# EAGLE design crowd chase el (EAGLE 6.5.0)
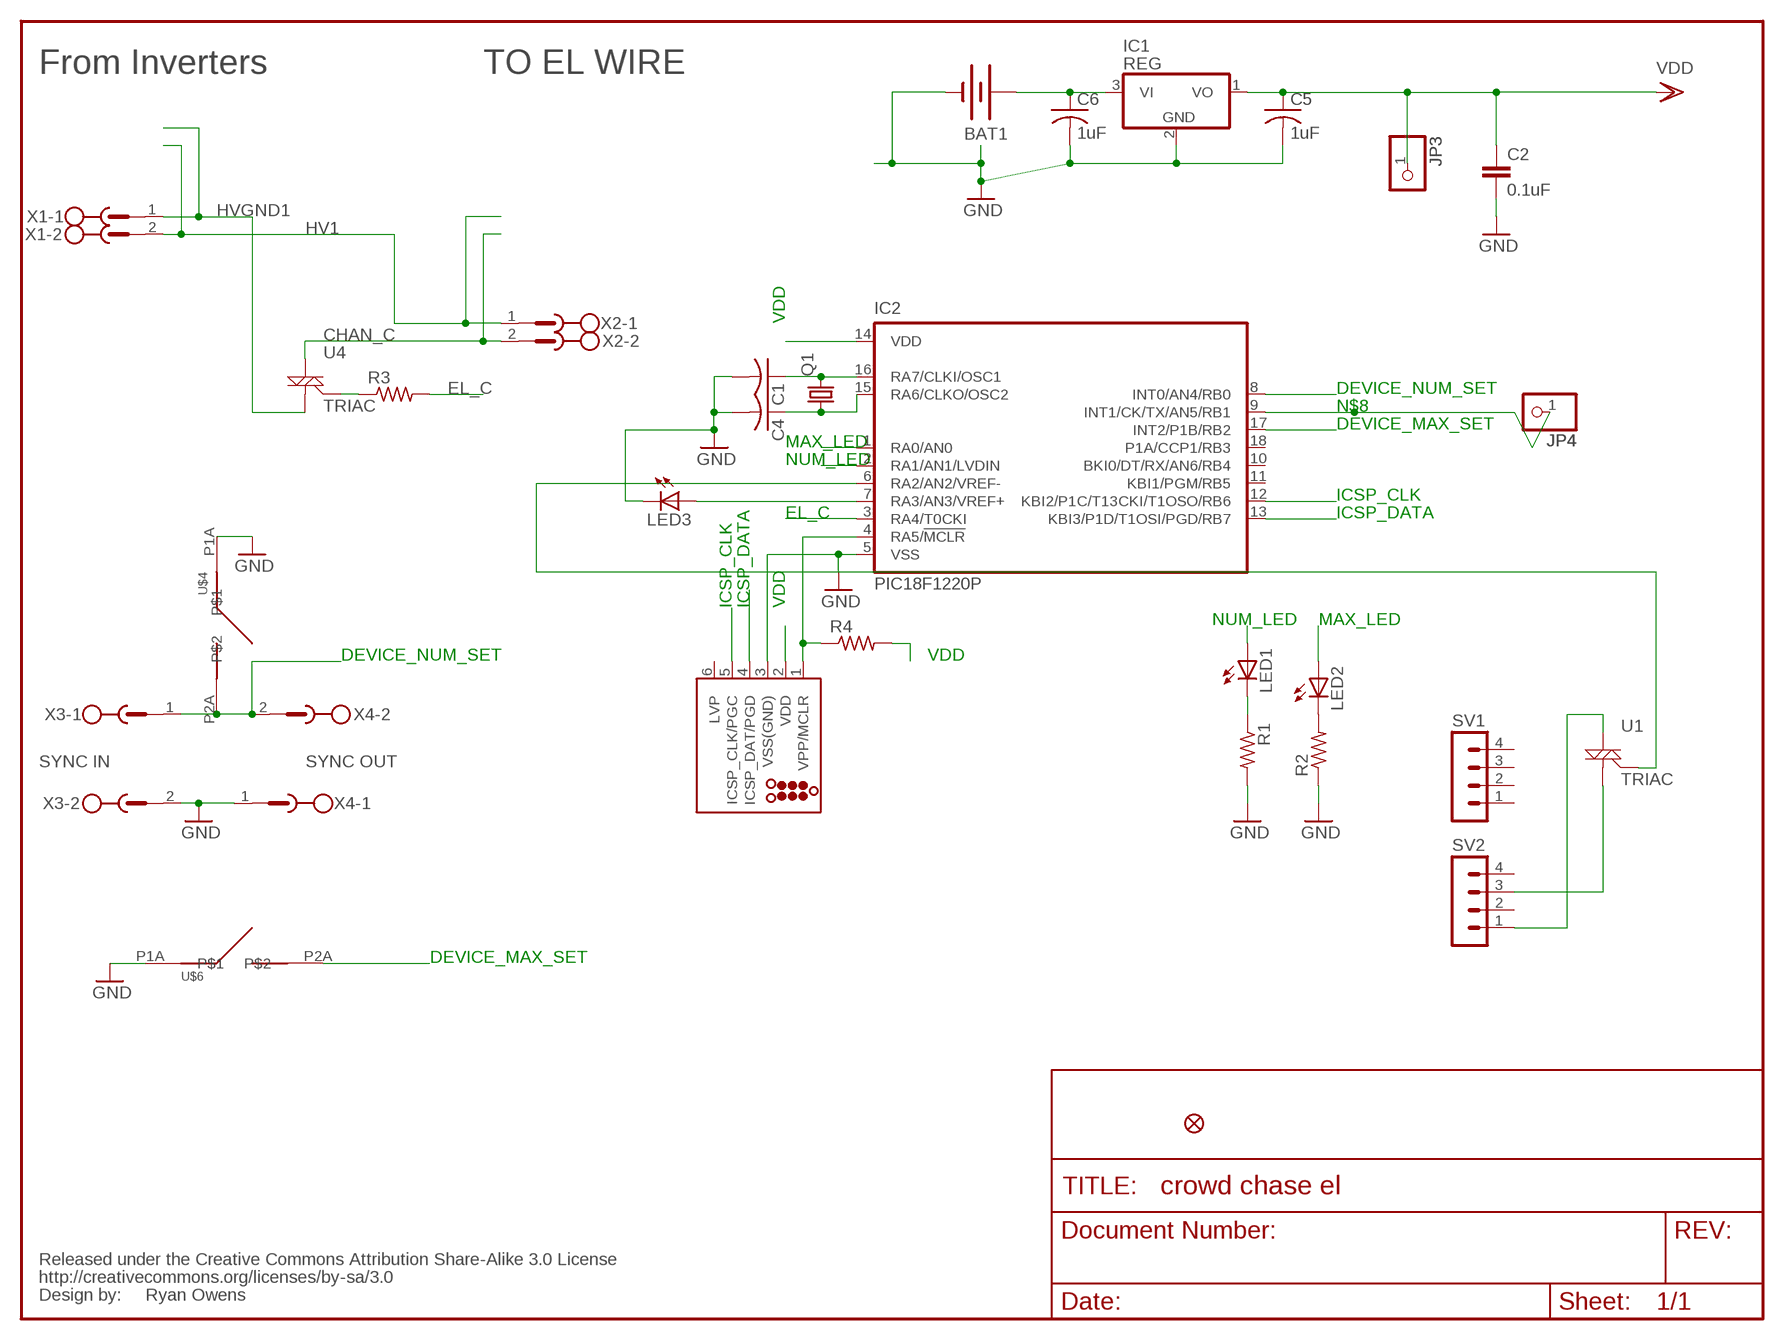
[diagram p0: schematic, sheet 1]

## Parts
BAT1  BATTERY20SMD-L  [BATTCON_20MM]
C1  C-US025-025X050  [C025-025X050]
C2  0.1uF  CAPPTH2  [CAP-PTH-SMALL2]
C4  C-US025-025X050  [C025-025X050]
C5  1uF  C-US025-025X050  [C025-025X050]
C6  1uF  C-US025-025X050  [C025-025X050]
IC1  REG  7805L  [TO92]
IC2  PIC18F1220P  [DIL18]
J2  TC2030  [TC2030-MCP-NL-CP]
JP3  PINHEADER_1X1  [HEADER_DIP_1X01]
JP4  PINHEADER_1X1  [HEADER_DIP_1X01]
LED1  LED3MM  [LED3MM]
LED2  LED3MM  [LED3MM]
LED3  LED3MM  [LED3MM]
Q1  CRYSTALHC49S  [HC49/S]
R1  R-US_0204/5  [0204/5]
R2  R-US_0204/5  [0204/5]
R3  R-US_0204/5  [0204/5]
R4  R-US_0204/5  [0204/5]
SV1  MA04-1  [MA04-1]
SV2  MA04-1  [MA04-1]
U1  TRIAC  TRIACPTH  [TO-92]
U4  TRIAC  TRIACPTH  [TO-92]
U$2  FIDUCIAL1X2  [FIDUCIAL-1X2]
U$4  12MMTACT_MJTP1212  [MJTP1212]
U$5  CREATIVE_COMMONS  [CREATIVE_COMMONS]
U$6  12MMTACT_MJTP1212  [MJTP1212]
X1  MSTBV2  [MSTBV2]
X2  MSTBV2  [MSTBV2]
X3  MSTBV2  [MSTBV2]
X4  MSTBV2  [MSTBV2]

## Nets
CHAN_C: U4.3(M2) X2.2
DEVICE_MAX_SET: IC2.17(INT2/P1B/RB2) U$6.P2A
DEVICE_NUM_SET: IC2.8(INT0/AN4/RB0) U$4.P2A X3.1 X4.2
EL_C: IC2.3(RA4/T0CKI) R3.2
GND: BAT1.2(-) C1.2 C2.2 C4.2 C5.2 C6.2 IC1.2(GND) IC2.5(VSS) J2.3(VSS(GND)) LED3.K(C) R1.2 R2.1 U$4.P1A U$6.P1A X3.2 X4.1
HV1: X1.2 X2.1
HVGND1: U4.1(M1) X1.1
ICSP_CLK: IC2.12(KBI2/P1C/T13CKI/T1OSO/RB6) J2.5(ICSP_CLK/PGC)
ICSP_DATA: IC2.13(KBI3/P1D/T1OSI/PGD/RB7) J2.4(ICSP_DAT/PGD)
MAX_LED: IC2.1(RA0/AN0) LED2.A
N$1: IC2.4(RA5/!MCLR) J2.1(VPP/MCLR) R4.1
N$2: C4.1 IC2.15(RA6/CLKO/OSC2) Q1.1
N$3: C1.1 IC2.16(RA7/CLKI/OSC1) Q1.2
N$5: LED1.K(C) R1.1
N$6: LED2.K(C) R2.2
N$7: IC2.7(RA3/AN3/VREF+) LED3.A
N$8: IC2.9(INT1/CK/TX/AN5/RB1) JP4.1
N$9: BAT1.3(+) C6.1 IC1.3(VI)
N$10: R3.1 U4.2(G)
N$12: SV2.1 U1.3(M2)
N$13: SV2.3 U1.1(M1)
N$14: IC2.6(RA2/AN2/VREF-) U1.2(G)
NUM_LED: IC2.2(RA1/AN1/LVDIN) LED1.A
VDD: C2.1 C5.1 IC1.1(VO) IC2.14(VDD) J2.2(VDD) JP3.1 R4.2
Unconnected: IC2.10(BKI0/DT/RX/AN6/RB4) IC2.11(KBI1/PGM/RB5) IC2.18(P1A/CCP1/RB3) J2.6(LVP) SV1.1 SV1.2 SV1.3 SV1.4 SV2.2 SV2.4

## Notes on the sheet
- From Inverters | TO EL WIRE
- SYNC IN | SYNC OUT
- Ryan Owens

## Library data of the parts
BAT1 = alertus-marquee:BATTERY: Battery Holders Various common sizes : AA, AAA, 20mm coin cell and 12mm coin cell.
C1 C4-C6 = rcl:C-US: CAPACITOR, American symbol
C2 = SparkFun:CAP: Capacitor Standard 0603 ceramic capacitor, and 0.1" leaded capacitor.
IC1 = linear:78*: Positive VOLTAGE REGULATOR Source: http://cache.national.com/ds/LM/LM78L05.pdf http://www.fairchildsemi.com/ds/LM/LM7805.pdf
IC2 = microchip:PIC18F1*20: 18/20/28-Pin High-Performance, Enhanced Flash Microcontrollers with 10-bit A/D and nanoWatt Technology Source: ww1.microchip.com/downloads/en/DeviceDoc/39605c.pdf; MF: MICROCHIP; MPN: PIC18F1220-I/P; OC_FARNELL: 9761977; OC_NEWARK: 92C2429
J2 = tag-connect:TC2030: TAG-CONNECT ICSP Connector Manufacturer: Tag-Connect <http://www.tag-connect.com> Cable for easy In-Circuit Serial Programming. Designed for Microchip ICD2, suitable for many others. Two variants - one "with legs" (for hands-free fit on PCB) and another "without legs" for quick programming. PAD Description 1 MCLR/Vpp 2 Vdd 3 GND 4 PGD (ISPDAT) 5 PGC (ISPCLK) 6 nc (used for LVP) ©2009 ROFA.cz - modified and updated by Robert Darlington ‹rdarlington@gmail.com›
JP3 JP4 = alertus-general:PINHEADER_1X1: PIN HEADER
LED1-LED3 = led:LED: LED OSRAM: - CHIPLED LG R971, LG N971, LY N971, LG Q971, LY Q971, LO R971, LY R971 LH N974, LH R974 LS Q976, LO Q976, LY Q976 LO Q996 - Hyper CHIPLED LW Q18S LB Q993, LB Q99A, LB R99A - SideLED LS A670, LO A670, LY A670, LG A670, LP A670 LB A673, LV A673, LT A673, LW A673 LH A674 LY A675 LS A676, LA A676, LO A676, LY A676, LW A676 LS A679, LY A679, LG A679 - Hyper Micro SIDELED® LS Y876, LA Y876, LO Y876, LY Y876 LT Y87S - SmartLED LW L88C, LW L88S LB L89C, LB L89S, LG L890 LS L89K, LO L89K, LY L89K LS L896, LA L896, LO L896, LY L896 - TOPLED LS T670, LO T670, LY T670, LG T670, LP T670 LSG T670, LSP T670, LSY T670, LOP T670, LYG T670 LG T671, LOG T671, LSG T671 LB T673, LV T673, LT T673, LW T673 LH T674 LS T676, LA T676, LO T676, LY T676, LB T676, LH T676, LSB T676, LW T676 LB T67C, LV T67C, LT T67C, LS T67K, LO T67K, LY T67K, LW E67C LS E67B, LA E67B, LO E67B, LY E67B, LB E67C, LV E67C, LT E67C LW T67C LS T679, LY T679, LG T679 LS T770, LO T770, LY T770, LG T770, LP T770 LB T773, LV T773, LT T773, LW T773 LH T774 LS E675, LA E675, LY E675, LS T675 LS T776, LA T776, LO T776, LY T776, LB T776 LHGB T686 LT T68C, LB T68C - Hyper Mini TOPLED® LB M676 - Mini TOPLED Santana® LG M470 LS M47K, LO M47K, LY M47K Source: http://www.osram.convergy.de LUXEON: - LUMILED® LXK2-PW12-R00, LXK2-PW12-S00, LXK2-PW14-U00, LXK2-PW14-V00 LXK2-PM12-R00, LXK2-PM12-S00, LXK2-PM14-U00 LXK2-PE12-Q00, LXK2-PE12-R00, LXK2-PE12-S00, LXK2-PE14-T00, LXK2-PE14-U00 LXK2-PB12-K00, LXK2-PB12-L00, LXK2-PB12-M00, LXK2-PB14-N00, LXK2-PB14-P00, LXK2-PB14-Q00 LXK2-PR12-L00, LXK2-PR12-M00, LXK2-PR14-Q00, LXK2-PR14-R00 LXK2-PD12-Q00, LXK2-PD12-R00, LXK2-PD12-S00 LXK2-PH12-R00, LXK2-PH12-S00 LXK2-PL12-P00, LXK2-PL12-Q00, LXK2-PL12-R00 Source: www.luxeon.com KINGBRIGHT: KA-3528ASYC Source: www.kingbright.com
Q1 = crystal:CRYSTAL: CRYSTAL; OC_FARNELL: 1667008; OC_NEWARK: unknown
R1 R2 R4 = resistor:R-US_: RESISTOR, American symbol
R3 = rcl:R-US_: RESISTOR, American symbol
SV1 SV2 = con-lstb:MA04-1: PIN HEADER; OC_FARNELL: unknown; OC_NEWARK: unknown
U1 U4 = SparkFun:TRIAC
U$2 = SparkFun:FIDUCIAL: Fiducial Alignment Points Various fiducial points for machine vision alignment.
U$4 U$6 = chasetron:12MMTACT_MJTP1212: 12MM Tact Switch MJTP1212A Digikey Part Number: 679-2424-ND
U$5 = SparkFun:CREATIVE_COMMONS
X1-X4 = con-phoenix-500:MSTBV2: PHOENIX; OC_FARNELL: unknown; OC_NEWARK: unknown

## Net classes
0 Default: width 0.203 mm
1 VCC: width 0.305 mm
2 GND: width 0.813 mm
3 HV: width 0.381 mm

## Board
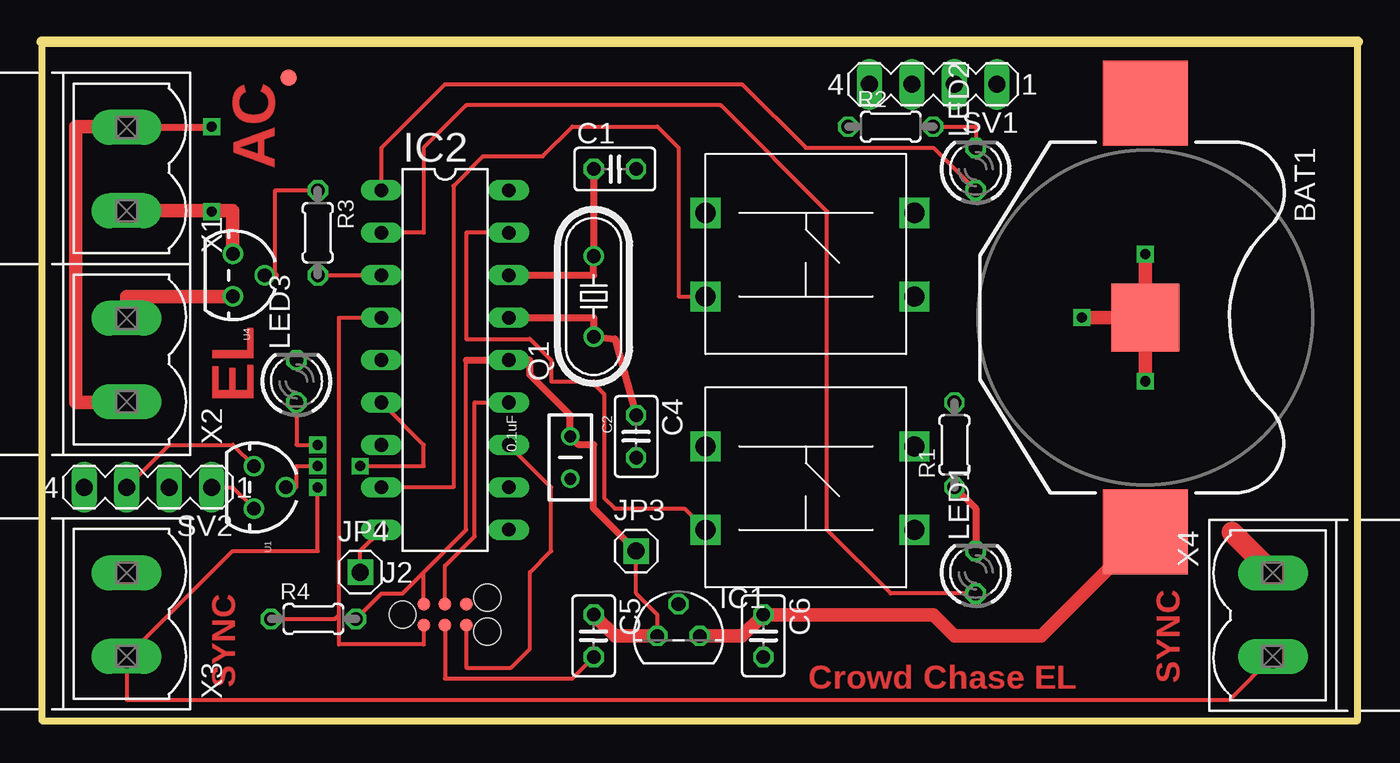
[diagram p1: board, top side]
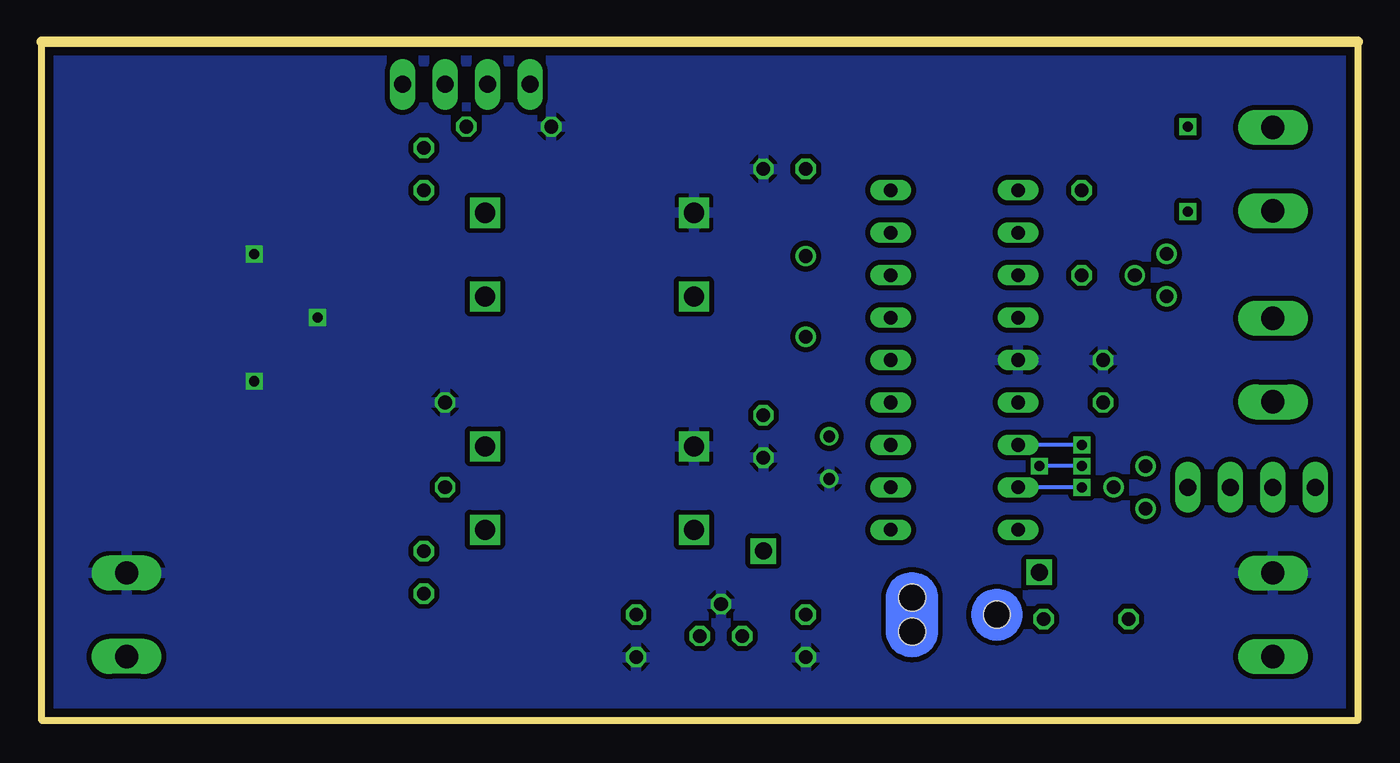
[diagram p2: board, bottom side, seen from below]

Size 78.74 x 40.64 mm. Coordinates in mm from the lower left corner, seen from the top.
Outline: 0,40.64 78.74,40.64 78.74,0 0,0 0,40.64
Copper layers (1*16): Top 0.0178mm / dielectric 59mil / Bottom 0.0178mm
Design rules "SSC-EAGLE-2Lyr_v1.0.0.3": minimum track width 6mil, minimum drill 14mil, track to track 6mil, track to pad 6mil, pad to pad 6mil, via to via 6mil, smd to smd 6mil, copper to edge 20mil, drill to drill 16mil, minimum pad ring 8mil, minimum via ring 8mil, stop-mask expansion 3mil, vias tented up to drill 0mil, thermal gap 10mil

### Footprints (pad centres in the part's own frame; a part is rotated, then mirrored left to right if it is on the bottom)
BATTCON_20MM = smd 5.08 x 5.08: 1 -12.827,0; 3 12.827,0 | smd 4.064 x 4.064: 2 0,0
C025-025X050 = drill 0.813 octagon: 1 -1.27,0; 2 1.27,0
CAP-PTH-SMALL2 = drill 0.7: 1 0,0; 2 2.54,0
TO92 = drill 0.813 octagon: 1 -1.27,0; 2 0,1.905; 3 1.27,0
DIL18 = drill 0.813 long: 1 -10.16,-3.81; 2 -7.62,-3.81; 3 -5.08,-3.81; 4 -2.54,-3.81; 5 0,-3.81; 6 2.54,-3.81; 7 5.08,-3.81; 8 7.62,-3.81; 9 10.16,-3.81; 10 10.16,3.81; 11 7.62,3.81; 12 5.08,3.81; 13 2.54,3.81; 14 0,3.81; 15 -2.54,3.81; 16 -5.08,3.81; 17 -7.62,3.81; 18 -10.16,3.81
TC2030-MCP-NL-CP = smd 0.787 x 0.787: 1 1.27,-0.635; 2 1.27,0.635; 3 2.54,-0.635; 4 2.54,0.635; 5 3.81,-0.635; 6 3.81,0.635 | hole 1.6: 0,0; 5.08,1.016; 5.08,-1.016
HEADER_DIP_1X01 = drill 1.016 square: 1 0,0
LED3MM = drill 0.813 octagon: A -1.27,0; K 1.27,0
HC49/S = drill 0.813: 1 -2.413,0; 2 2.413,0
0204/5 = drill 0.813 octagon: 1 -2.54,0; 2 2.54,0
MA04-1 = drill 1.016 long: 1 -3.81,0; 2 -1.27,0; 3 1.27,0; 4 3.81,0
TO-92 = drill 0.813: 1 -1.27,0; 2 0,1.905; 3 1.27,0
FIDUCIAL-1X2 = smd 1 x 1: 1 0,0
MJTP1212 = drill 1.2 square: P1A -6,2.46; P1B 6.5,2.46; P2A -6,-2.54; P2B 6.5,-2.54
MSTBV2 = drill 1.397 long: 1 -2.5,0; 2 2.5,0

### Placement (x,y rotation side)
BAT1  66.04,24.13 270 top
C1  34.29,33.02 0 top
C2  31.62,17.02 270 top
C4  35.56,17.02 270 top
C5  33.02,5.08 270 top
C6  43.18,5.08 270 top
IC1  38.1,5.08 0 top
IC2  24.13,21.59 270 top
J2  21.59,6.35 0 top
JP3  35.56,10.16 0 top
JP4  19.05,8.89 0 top
LED1  55.88,8.89 90 top
LED2  55.88,33.02 90 top
LED3  15.24,20.32 90 top
Q1  33.02,25.4 90 top
R1  54.61,16.51 90 top
R2  50.8,35.56 0 top
R3  16.51,29.21 270 top
R4  16.26,6.1 0 top
SV1  53.34,38.1 180 top
SV2  6.35,13.97 180 top
U1  12.7,13.97 270 top
U4  11.43,26.67 270 top
U$2  14.78,38.48 0 top
U$4  45.72,27.94 0 top
U$5  21.59,-8.89 0 top  (outside the outline)
U$6  45.72,13.97 0 top
X1  5.08,33.02 90 top
X2  5.08,21.59 90 top
X3  5.08,6.35 90 top
X4  73.66,6.35 270 top

### Tracks (layer width: path | path; a pad name or v marks a point on that pad's centre or on a via)
CHAN_C
  Top 0.813: U4.3 5.08,25.4 X2.2
DEVICE_MAX_SET
  Top 0.254: IC2.17 25.4,29.21 25.4,22.86 29.21,22.86 30.48,21.59 30.48,20.32 33.02,20.32 33.02,20.19 33.66,19.56 33.66,13.34 34.29,12.7 38.45,12.7 U$6.P2A
DEVICE_NUM_SET  (via drill 0.6)
  Top 0.254: X4.2 71.08,1.27 5.08,1.27 X3.1 5.12,3.85 11.43,10.16 16.51,10.16 v16.51,13.97 | IC2.8 24.64,13.97 24.64,32 26.42,33.78 29.97,33.78 31.75,35.56 36.83,35.56 38.1,34.29 38.1,25.4 U$4.P2A
  Bottom 0.254: v16.51,13.97 IC2.8
EL_C
  Top 0.254: R3.2 IC2.3
GND  (via drill 0.6)
  Top 0.254: J2.3 24.13,2.54 31.75,2.54 C5.2
  Top 0.813: v62.23,24.13 BAT1.2 | BAT1.2 v66.04,20.32 | v66.04,27.94 BAT1.2
  Top 1.27: 71.21,11.3 X4.1
  pour Bottom (isolate 0.305): 0,0 78.74,0 78.74,40.64 0,40.64
HV1  (via drill 0.6)
  Top 0.406: X1.2 10.12,35.52 v10.16,35.56
  Top 0.813: X2.1 5.04,19.05 2.03,19.05 2.03,35.56 5.04,35.56 X1.2
HVGND1  (via drill 0.6)
  Top 0.254: v10.16,30.48 11.43,30.48
  Top 0.813: X1.1 11.43,30.52 11.43,30.48 U4.1
ICSP_CLK
  Top 0.254: J2.5 25.4,3.17 28.07,3.17 29.21,4.32 29.21,8.89 30.48,10.16 30.48,13.97 IC2.12
ICSP_DATA
  Top 0.254: J2.4 24.13,9.27 25.91,11.05 25.91,19.05 IC2.13
MAX_LED
  Top 0.254: IC2.1 20.32,34.29 24.13,38.1 41.91,38.1 45.72,34.29 53.34,34.29 LED2.A
N$1
  Top 0.254: J2.1 22.86,4.57 17.78,4.57 17.78,6.35 | 17.78,6.35 17.78,24.13 IC2.4 | R4.1 17.53,6.1 17.78,6.35
N$2
  Top 0.406: IC2.15 33.02,24.13 Q1.1 34.29,22.86 C4.1
N$3
  Top 0.406: IC2.16 33.02,26.67 Q1.2 C1.1
N$5
  Top 0.406: R1.1 55.88,12.7 LED1.K
N$6
  Top 0.254: R2.2 55.88,35.56 LED2.K
N$7  (via drill 0.6)
  Top 0.254: LED3.A 15.24,16.51 v16.51,16.51
  Bottom 0.254: v16.51,16.51 IC2.7
N$8
  Top 0.254: JP4.1 19.05,10.16 IC2.9
N$9
  Top 0.813: IC1.3 41.91,5.08 C6.1 53.34,6.35 54.61,5.08 59.82,5.08 BAT1.3
N$10
  Top 0.254: 13.97,26.67 13.97,31.75 R3.1
  Top 0.406: U4.2 13.97,26.67
N$12
  Top 0.254: SV2.1 11.43,13.97 U1.3
N$13
  Top 0.254: SV2.3 7.62,16.51 11.43,16.51 U1.1
N$14  (via drill 0.6)
  Top 0.254: U1.2 15.24,13.97 15.24,15.24 v16.51,15.24 | v19.05,15.24 22.86,15.24 22.86,16.51 IC2.6
  Bottom 0.254: v16.51,15.24 v19.05,15.24
NUM_LED
  Top 0.254: LED1.A 50.8,7.62 46.99,11.43 46.99,30.48 40.64,36.83 25.4,36.83 22.86,34.29 22.86,29.21 IC2.2
VDD
  Top 0.254: J2.2 22.86,8.89 | 22.86,8.89 25.4,11.43 25.4,21.59 | IC1.1 36.83,6.35 35.56,7.62 JP3.1 | R4.2 20.32,7.62 21.59,7.62 22.86,8.89
  Top 0.406: 25.4,21.59 IC2.14 29.21,21.59 29.21,20.7 31.62,18.29 C2.1 32.13,16.51 33.02,16.51 33.02,12.7 JP3.1
  Top 0.813: IC1.1 34.29,5.08 C5.1

### Text on the board
Top: AC | EL | SYNC | SYNC | Crowd Chase EL
tValues: Blake Robertson